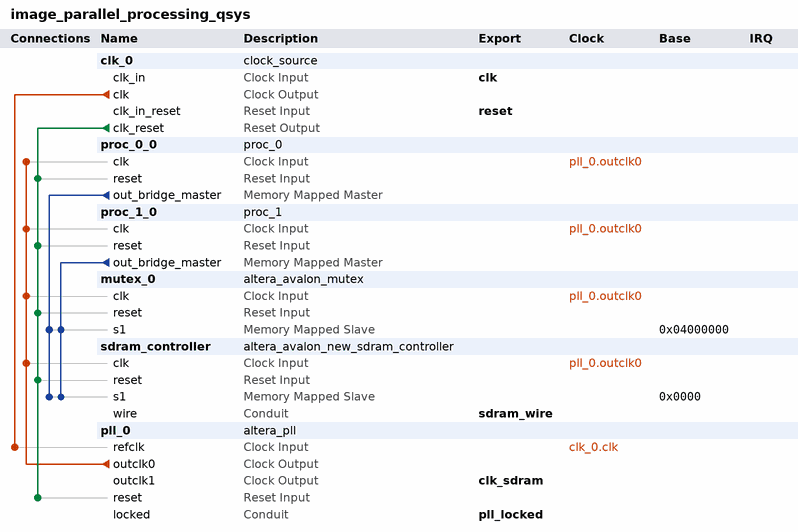
[diagram p0: system contents]
# Platform Designer (Qsys) system image_parallel_processing_qsys, Cyclone V 5CSEMA5F31C6
# Parameters at their usual value, and those the tool derives, are not listed.
package require -exact qsys 16.1
create_system image_parallel_processing_qsys
set_project_property DEVICE_FAMILY {Cyclone V}
set_project_property DEVICE 5CSEMA5F31C6

add_instance clk_0 clock_source 16.1
set_instance_parameter_value clk_0 clockFrequency 50000000

add_instance proc_0_0 proc_0 1.0

add_instance proc_1_0 proc_1 1.0

add_instance mutex_0 altera_avalon_mutex 16.1

add_instance sdram_controller altera_avalon_new_sdram_controller 16.1
set_instance_parameter_value sdram_controller TAC 5.4
set_instance_parameter_value sdram_controller TRCD 15.0
set_instance_parameter_value sdram_controller TRP 15.0
set_instance_parameter_value sdram_controller casLatency 3
set_instance_parameter_value sdram_controller columnWidth 10
set_instance_parameter_value sdram_controller dataWidth 16
set_instance_parameter_value sdram_controller generateSimulationModel false
set_instance_parameter_value sdram_controller model single_Micron_MT48LC4M32B2_7_chip
set_instance_parameter_value sdram_controller numberOfBanks 4
set_instance_parameter_value sdram_controller numberOfChipSelects 1
set_instance_parameter_value sdram_controller powerUpDelay 100.0
set_instance_parameter_value sdram_controller refreshPeriod 7.8125
set_instance_parameter_value sdram_controller rowWidth 13

add_instance pll_0 altera_pll 16.1
set_instance_parameter_value pll_0 gui_device_speed_grade 1
set_instance_parameter_value pll_0 gui_number_of_clocks 2
set_instance_parameter_value pll_0 gui_operation_mode direct
set_instance_parameter_value pll_0 gui_output_clock_frequency0 143.0
set_instance_parameter_value pll_0 gui_output_clock_frequency1 143.0
set_instance_parameter_value pll_0 gui_phase_shift1 -3800
set_instance_parameter_value pll_0 gui_phase_shift_deg1 324.0
set_instance_parameter_value pll_0 gui_pll_mode {Integer-N PLL}
set_instance_parameter_value pll_0 gui_reference_clock_frequency 50.0
set_instance_parameter_value pll_0 gui_use_locked true

# connections
add_connection clk_0.clk pll_0.refclk clock
add_connection pll_0.outclk0 mutex_0.clk clock
add_connection pll_0.outclk0 proc_0_0.clk clock
add_connection pll_0.outclk0 proc_1_0.clk clock
add_connection pll_0.outclk0 sdram_controller.clk clock
add_connection clk_0.clk_reset mutex_0.reset reset
add_connection clk_0.clk_reset pll_0.reset reset
add_connection clk_0.clk_reset proc_0_0.reset reset
add_connection clk_0.clk_reset proc_1_0.reset reset
add_connection clk_0.clk_reset sdram_controller.reset reset
add_connection proc_0_0.out_bridge_master mutex_0.s1 avalon
set_connection_parameter_value proc_0_0.out_bridge_master/mutex_0.s1 baseAddress 0x04000000
add_connection proc_0_0.out_bridge_master sdram_controller.s1 avalon
set_connection_parameter_value proc_0_0.out_bridge_master/sdram_controller.s1 baseAddress 0x0000
add_connection proc_1_0.out_bridge_master mutex_0.s1 avalon
set_connection_parameter_value proc_1_0.out_bridge_master/mutex_0.s1 baseAddress 0x04000000
add_connection proc_1_0.out_bridge_master sdram_controller.s1 avalon
set_connection_parameter_value proc_1_0.out_bridge_master/sdram_controller.s1 baseAddress 0x0000

# exported interfaces
add_interface clk clock sink
set_interface_property clk EXPORT_OF clk_0.clk_in
add_interface clk_sdram clock source
set_interface_property clk_sdram EXPORT_OF pll_0.outclk1
add_interface pll_locked conduit end
set_interface_property pll_locked EXPORT_OF pll_0.locked
add_interface reset reset sink
set_interface_property reset EXPORT_OF clk_0.clk_in_reset
add_interface sdram_wire conduit end
set_interface_property sdram_wire EXPORT_OF sdram_controller.wire

set_interconnect_requirement {$system} qsys_mm.clockCrossingAdapter HANDSHAKE
set_interconnect_requirement {$system} qsys_mm.enableEccProtection FALSE
set_interconnect_requirement {$system} qsys_mm.insertDefaultSlave FALSE
set_interconnect_requirement {$system} qsys_mm.maxAdditionalLatency 1

save_system image_parallel_processing_qsys.qsys
